# Altium schematic sheet I_measurement_lut.SchDoc
size A2
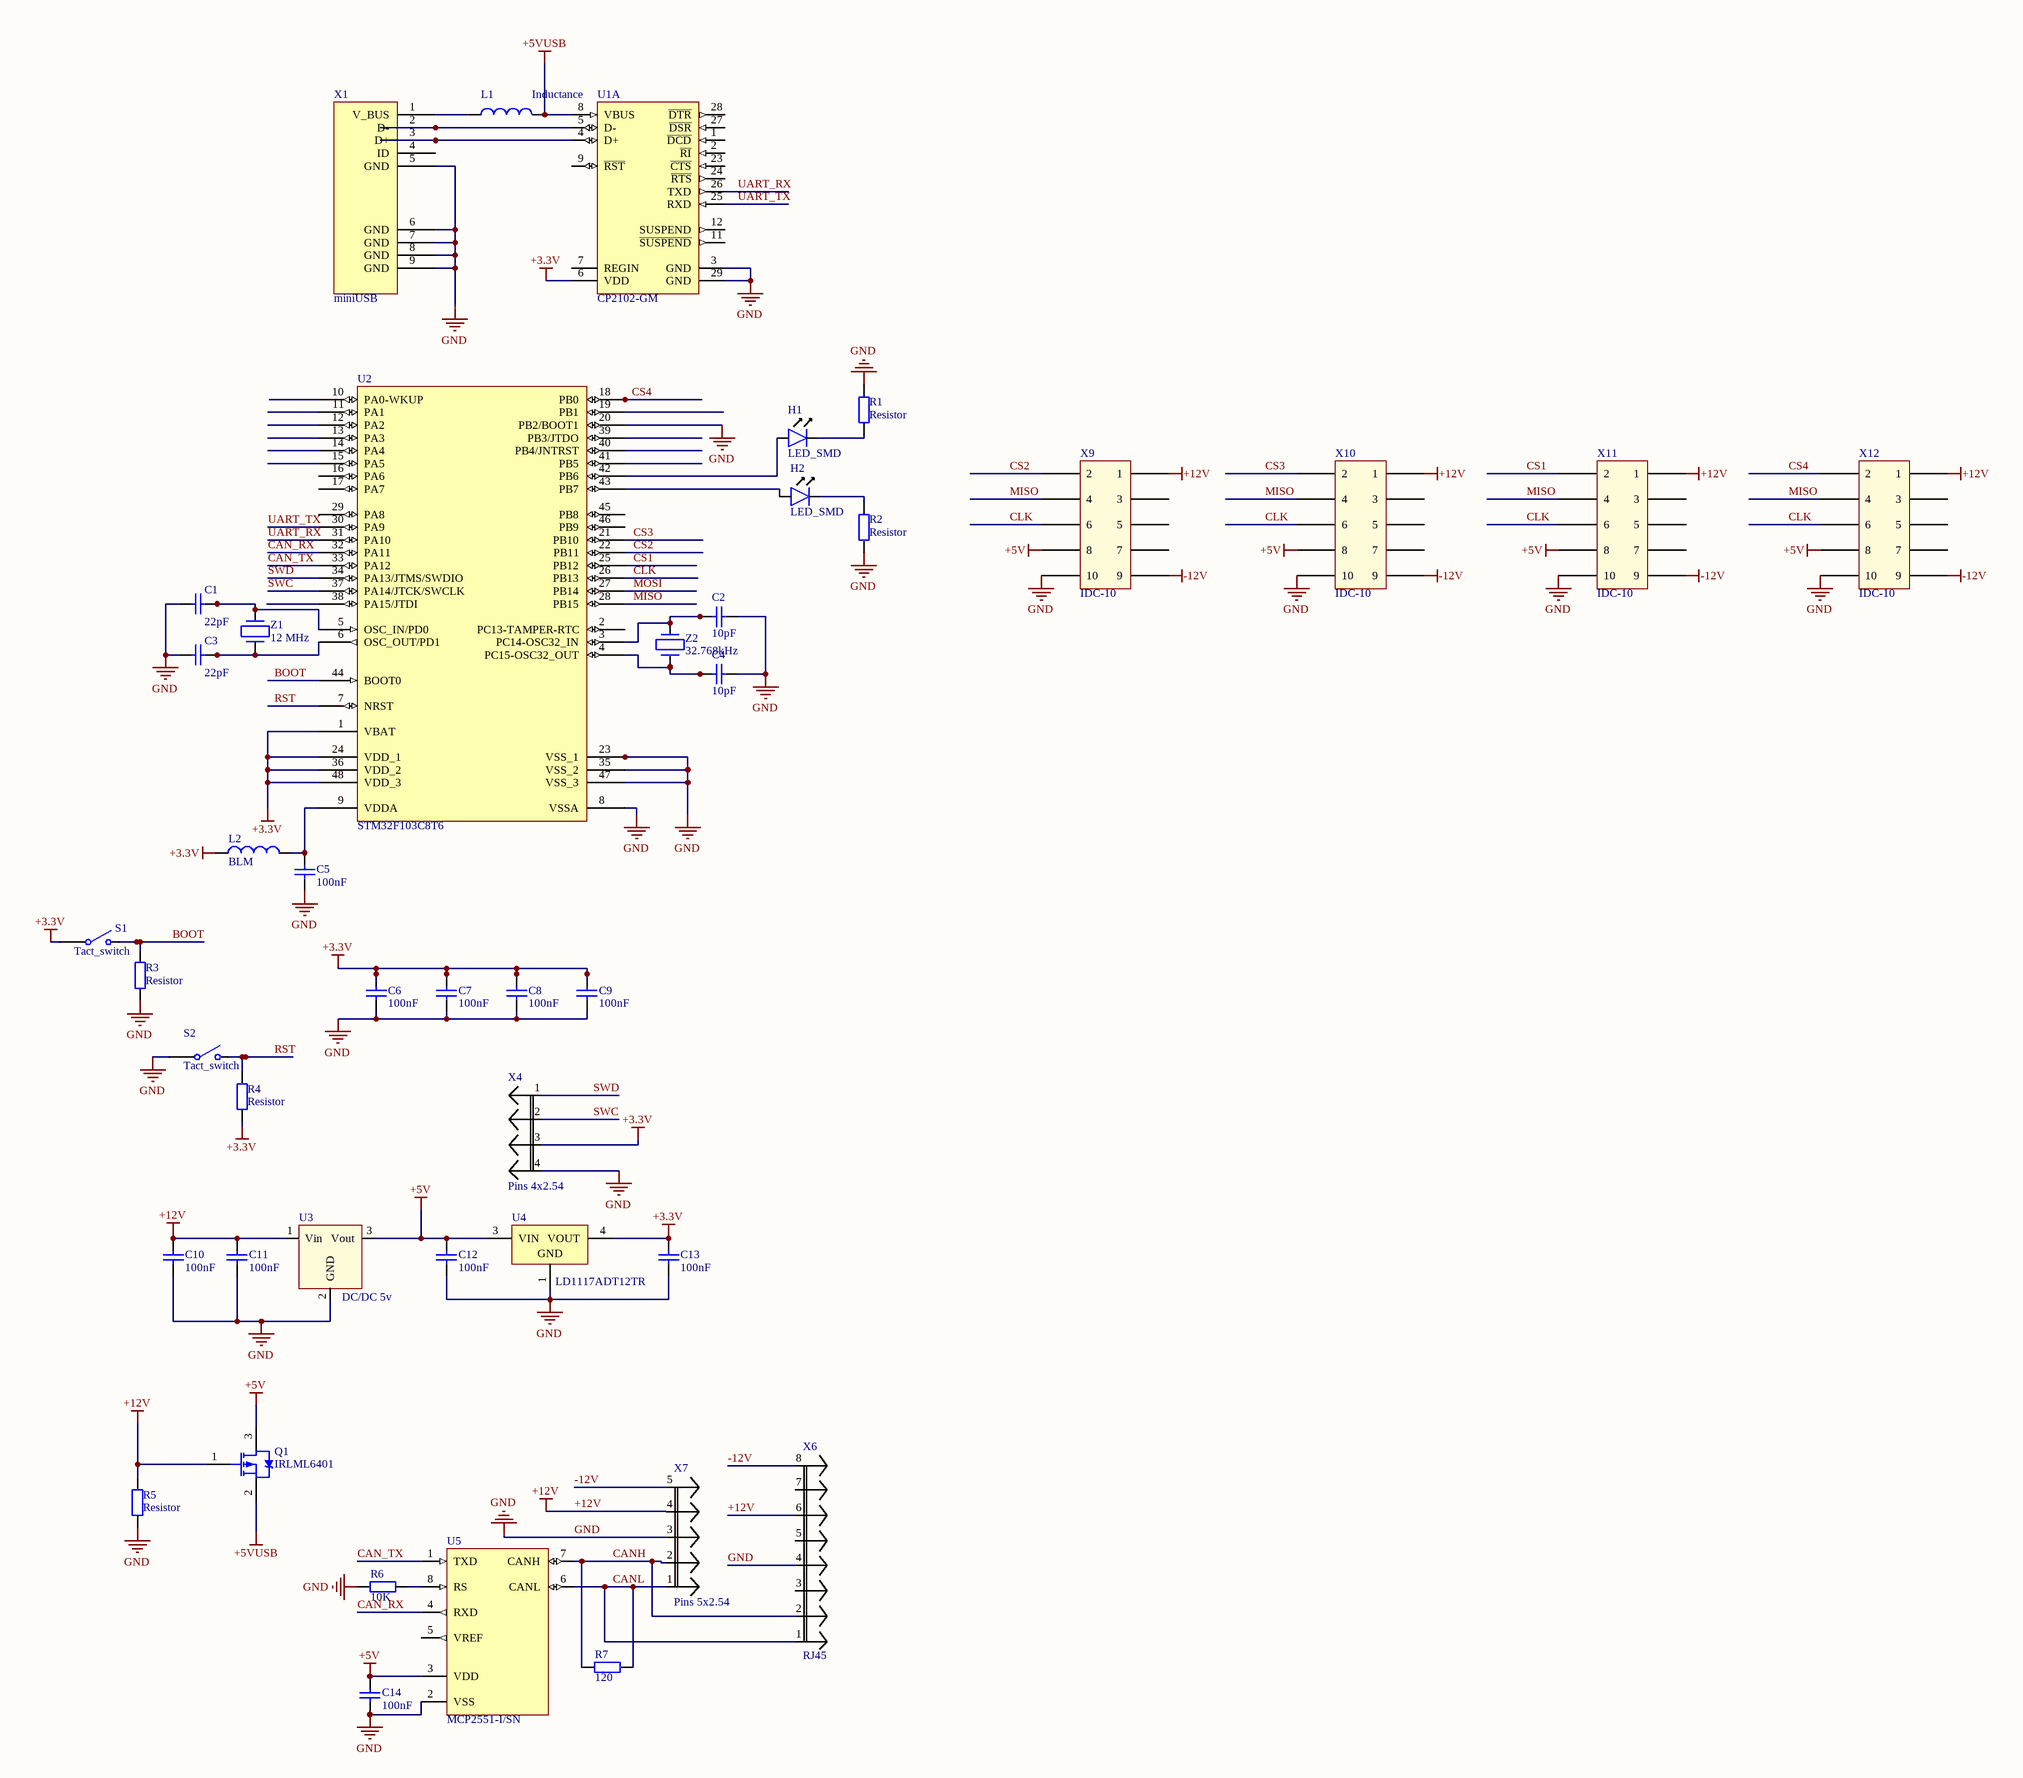
[diagram p0: I_measurement_lut.SchDoc]

## Parts
C1  22pF  [C0805]
C2  10pF  [C0805]
C3  22pF  [C0805]
C4  10pF  [C0805]
C5  100nF  [C0805]
C6  100nF  [C0805]
C7  100nF  [C0805]
C8  100nF  [C0805]
C9  100nF  [C0805]
C10  100nF  [C0805]
C11  100nF  [C0805]
C12  100nF  [C0805]
C13  100nF  [C0805]
C14  100nF  [C0805]
H1  LED_SMD  [C0805]
H2  LED_SMD  [C0805]
L1  Inductance  [L0805]
L2  BLM  [L0805]
Q1  IRLML6401  [sot-23]
R1  Resistor  [R0805]
R2  Resistor  [R0805]
R3  Resistor  [R0805]
R4  Resistor  [R0805]
R5  Resistor  [R0805]
R6  10K  [R0805]
R7  120  [R0805]
S1  Tact_switch  [Tact_switch_smd]
S2  Tact_switch  [Tact_switch_smd]
U1  CP2102-GM  [SLAB-QFN-28-3125x3125TP_N]  (part A of 2)
U2  STM32F103C8T6  [LQFP48_N]
U3  DC/DC 5v  [DC/DC R-78E]
U4  LD1117ADT12TR  [TO-252_N]
U5  MCP2551-I/SN  [SOIC-SN8_N]
X1  miniUSB  [miniUSB]
X4  Pins 4x2.54  [Pins 4x2.54]
X6  RJ45  [RJ45]
X7  Pins 5x2.54  [Pins 5x2.54]
X9  IDC-10  [IDC-10]
X10  IDC-10  [IDC-10]
X11  IDC-10  [IDC-10]
X12  IDC-10  [IDC-10]
Z1  12 MHz  [kx 13 12MHz]
Z2  32.768kHz  [Geyer KX - 327S 32.768kHz]

## Nets
+3.3V: C6.2 C7.2 C8.2 C9.2 C13.2 L2.1 R4.1 S1.1(COMMON) U1.6(VDD) U2.1(VBAT) U2.24(VDD_1) U2.36(VDD_2) U2.48(VDD_3) U4.4(VOUT) X4.3
+5V: C12.2 C14.2 Q1.3(D) U3.3(Vout) U4.3(VIN) U5.3(VDD) X9.8 X10.8 X11.8 X12.8
+5VUSB: L1.2 Q1.2(S) U1.8(VBUS)
+12V: C10.2 C11.2 Q1.1(G) R5.2 U3.1(Vin) X6.6 X7.4 X9.1 X10.1 X11.1 X12.1
-12V: X6.8 X7.5 X9.9 X10.9 X11.9 X12.9
GND: C1.1 C2.1 C3.1 C4.1 C5.1 C6.1 C7.1 C8.1 C9.1 C10.1 C11.1 C12.1 C13.1 C14.1 R1.2 R2.1 R3.1 R5.1 R6.1 S2.1(COMMON) U1.3(GND) U1.29(GND) U2.8(VSSA) U2.20(PB2/BOOT1) U2.23(VSS_1) U2.35(VSS_2) U2.47(VSS_3) U3.2(GND) U4.1(GND) U5.2(VSS) X1.5(GND) X1.6(GND) X1.7(GND) X1.8(GND) X1.9(GND) X4.4 X6.4 X7.3 X9.10 X10.10 X11.10 X12.10
BOOT: R3.2 S1.2(NO) U2.44(BOOT0)
CAN_RX: U2.32(PA11) U5.4(RXD)
CAN_TX: U2.33(PA12) U5.1(TXD)
CANH: R7.2 U5.7(CANH) X6.2 X7.2
CANL: R7.1 U5.6(CANL) X6.1 X7.1
CLK: U2.26(PB13) X9.6 X10.6 X11.6 X12.6
CS1: U2.25(PB12) X11.2
CS2: U2.22(PB11) X9.2
CS3: U2.21(PB10) X10.2
CS4: U2.18(PB0) X12.2
MISO: U2.28(PB15) X9.4 X10.4 X11.4 X12.4
MOSI: U2.27(PB14)
RST: R4.2 S2.2(NO) U2.7(NRST)
SWC: U2.37(PA14/JTCK/SWCLK) X4.2
SWD: U2.34(PA13/JTMS/SWDIO) X4.1
UART_RX: U1.26(TXD) U2.31(PA10)
UART_TX: U1.25(RXD) U2.30(PA9)
NetC1_2: C1.2 U2.5(OSC_IN/PD0) Z1.1
NetC2_2: C2.2 U2.3(PC14-OSC32_IN) Z2.1
NetC3_2: C3.2 U2.6(OSC_OUT/PD1) Z1.3
NetC4_2: C4.2 U2.4(PC15-OSC32_OUT) Z2.2
NetC5_2: C5.2 L2.2 U2.9(VDDA)
NetH1_1: H1.1 U2.42(PB6)
NetH1_2: H1.2 R1.1
NetH2_1: H2.1 U2.43(PB7)
NetH2_2: H2.2 R2.2
NetL1_1: L1.1 X1.1(V_BUS)
NetR6_2: R6.2 U5.8(RS)
NetU1_4: U1.4(D+) X1.3(D+)
NetU1_5: U1.5(D-) X1.2(D-)

Not connected (* = marked no-connect by the designer): U1 1(~{DCD}) 2(~{RI}) 7(REGIN) 9(~{RST}) 11(~{SUSPEND}) 12(SUSPEND) 23(~{CTS}) 24(~{RTS}) 27(~{DSR}) 28(~{DTR}); U2 2(PC13-TAMPER-RTC) 10(PA0-WKUP) 11(PA1) 12(PA2) 13(PA3) 14(PA4) 15(PA5) 16(PA6) 17(PA7) 19(PB1) 29(PA8) 38(PA15/JTDI) 39(PB3/JTDO) 40(PB4/JNTRST) 41(PB5) 45(PB8) 46(PB9); U5 5(VREF); X1 4(ID); X6 3 5 7; X9 3 5 7; X10 3 5 7; X11 3 5 7; X12 3 5 7

## Library data of the parts
C1-C14 = Condensator
L2 = Inductance
R6 R7 = Resistor
U1 = CP2102-GM: Single-Chip USB to UART Bridge, 1024 Bytes EEPROM, -40 to 85 degC, 28-pin QFN, Tube; Manufacturer: Silicon Labs; Internal Oscillator: TRUE; Sub-Family: USB Bridges; DatasheetVersion: Rev. 1.5; PackageReference: QFN-28; PackageDescription: 28-Pin Quad-Flat No-Leads Package, Body 5 x 5 mm, Pitch 0.5 mm; Supplier 1: Digi-Key; Supplier Part Number 1: 336-1160-5-ND; Supplier 2: Farnell; Supplier Part Number 2: 9282130; Supplier 3: Newark; Supplier Part Number 3: 30K5635; Supplier 4: Mouser; Supplier Part Number 4: 634-CP2102-GM; EEPROM: 1024 Bytes; Mounting Technology: Surface Mount; Code_JEDEC: MO-220; Code_IPC: J-STD-020C; PartNumber: CP2102-GM; ComponentLink1Description: Manufacturer URL; ComponentLink1URL: http://www.silabs.com/; ComponentLink2Description: Datasheet; ComponentLink2URL: http://www.silabs.com/Support%20Documents/TechnicalDocs/CP2102-9.pdf; ComponentLink3Description: Package Specification; ComponentLink3URL: http://www.silabs.com/Support%20Documents/TechnicalDocs/C8051T61x.pdf
U2 = STM32F103C8T6: STM32 ARM-based 32-bit MCU with 64 Kbytes Flash, 48-pin LQFP, Industrial Temperature; Published: 30-May-2008; DatasheetVersion: rev6, Mar-2008; PackageVersion: Mar-2008; PackageReference: LQFP48; Publisher: Altium Limited; PackageDescription: 48-Pin Low-Profile Quad Flat Pack, 7 x 7 mm Body, 0.5 mm Pitch (LQFP48); ComponentLink1Description: Manufacturer Link; ComponentLink1URL: www.st.com/stm32; ComponentLink2Description: Datasheet; ComponentLink2URL: http://www.st.com/stonline/products/literature/ds/13587.pdf
U3 = DC/DC R-78E
U4 = LD1117ADT12TR: 1A, Low Drop Positive Voltage Regulator, 1.2V, 3-Pin DPAK, Tape and Reel; DatasheetVersion: Dec-2011; PackageVersion: 2011; PackageReference: TO-252; PackageDescription: 3-Pin Transistor Outline Package 2.28 mm Pitch, 9.7 mm Lead Span (DPAK); PartNumber: LD1117ADT12TR; ComponentLink1Description: Manufacturer URL; ComponentLink1URL: http://www.st.com; ComponentLink2Description: Datasheet; ComponentLink2URL: http://www.st.com/internet/com/TECHNICAL_RESOURCES/TECHNICAL_LITERATURE/DATASHEET/CD00002116.pdf
U5 = MCP2551-I/SN: High-Speed CAN Transceiver, 8-Pin SOIC, Industrial Temperature; Published: 29-Jan-2009; DatasheetVersion: revE, Jan-2007; PackageVersion: revBB, Aug-2009; PackageReference: SOIC-SN8; Publisher: Altium Limited; PackageDescription: 8-Lead Plastic Small Outline (SN) - Narrow, 3.90mm Body [SOIC]; Supplier 1: Digi-Key; Supplier Part Number 1: MCP2551-I/SN-ND; Supplier 2: Farnell; Supplier Part Number 2: 9758569; Code_JEDEC: MS-012; Code_IPC: SOIC127P600-8; ComponentLink1Description: Datasheet; ComponentLink1URL: http://ww1.microchip.com/downloads/en/DeviceDoc/21667E.pdf; ComponentLink2Description: Packaging Specification; ComponentLink2URL: http://www.microchip.com/stellent/groups/techpub_sg/documents/packagingspec/en012702.pdf; ComponentLink3Description: Microchip.com Home; ComponentLink3URL: http://www.microchip.com/
Z1 = KX 13 Geyer
Z2 = Crystal Oscillator